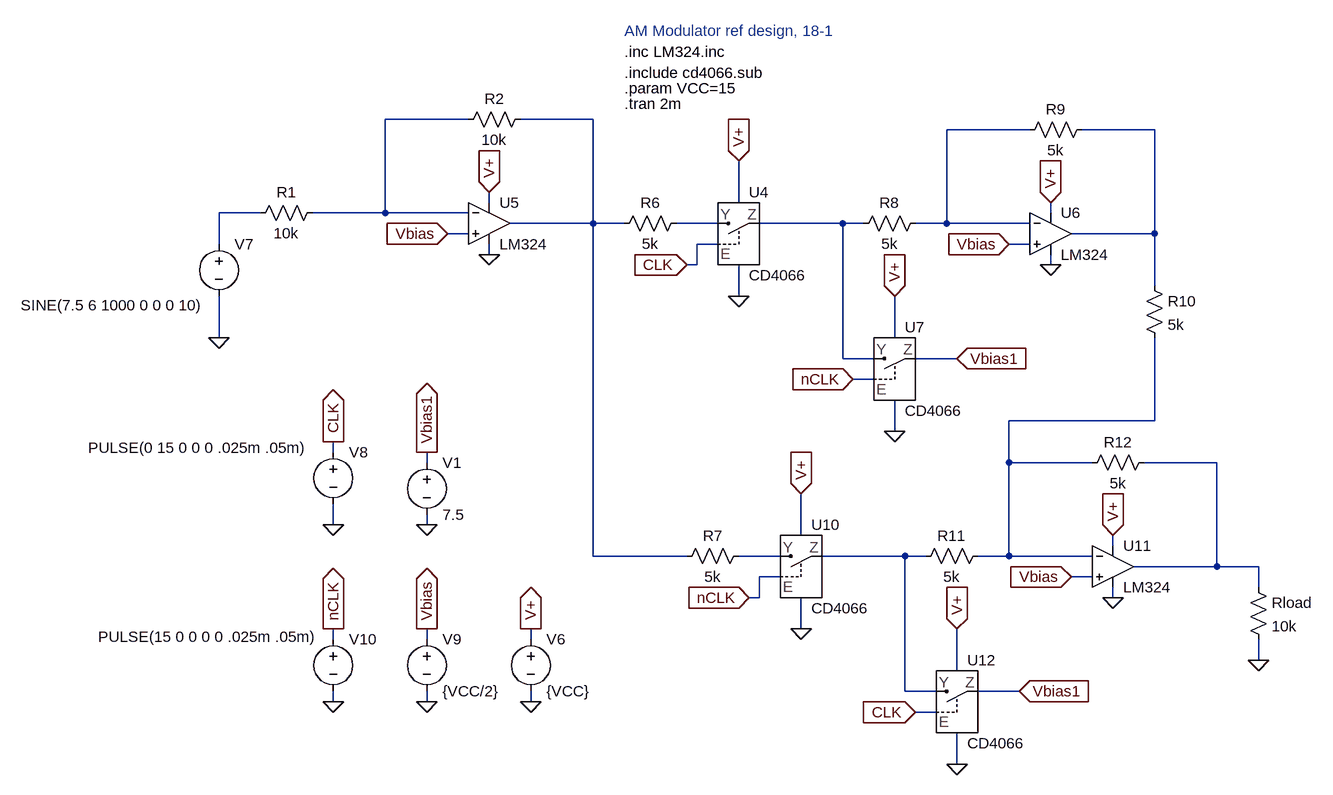
[diagram p0: schematic AM_modulator_ref_design.asc]
AM_modulator_ref_design.asc, the LTspice schematic file:
Version 4
SHEET 1 2644 1204
WIRE 1280 160 1152 160
WIRE 1472 160 1360 160
WIRE 2144 176 2016 176
WIRE 2336 176 2224 176
WIRE 1312 288 1312 272
WIRE 1696 288 1696 224
WIRE 960 304 896 304
WIRE 1152 304 1152 160
WIRE 1152 304 1040 304
WIRE 1280 304 1152 304
WIRE 2176 304 2176 288
WIRE 1472 320 1472 160
WIRE 1472 320 1344 320
WIRE 1520 320 1472 320
WIRE 1664 320 1600 320
WIRE 1856 320 1728 320
WIRE 1888 320 1856 320
WIRE 2016 320 2016 176
WIRE 2016 320 1968 320
WIRE 2144 320 2016 320
WIRE 1280 336 1248 336
WIRE 2336 336 2336 176
WIRE 2336 336 2208 336
WIRE 896 352 896 304
WIRE 1664 352 1632 352
WIRE 2144 352 2112 352
WIRE 1312 368 1312 352
WIRE 1632 384 1632 352
WIRE 1632 384 1616 384
WIRE 2176 384 2176 368
WIRE 2336 416 2336 336
WIRE 1696 432 1696 384
WIRE 896 496 896 432
WIRE 1936 496 1936 432
WIRE 1856 528 1856 320
WIRE 1904 528 1856 528
WIRE 2032 528 1968 528
WIRE 1904 560 1872 560
WIRE 2336 624 2336 496
WIRE 2336 624 2112 624
WIRE 1936 640 1936 592
WIRE 1072 672 1072 656
WIRE 1216 688 1216 672
WIRE 2112 688 2112 624
WIRE 2240 688 2112 688
WIRE 2432 688 2320 688
WIRE 1072 784 1072 752
WIRE 1216 784 1216 768
WIRE 1792 800 1792 736
WIRE 2272 816 2272 800
WIRE 1472 832 1472 320
WIRE 1616 832 1472 832
WIRE 1760 832 1696 832
WIRE 1952 832 1824 832
WIRE 1984 832 1952 832
WIRE 2112 832 2112 688
WIRE 2112 832 2064 832
WIRE 2240 832 2112 832
WIRE 2432 848 2432 688
WIRE 2432 848 2304 848
WIRE 2496 848 2432 848
WIRE 1760 864 1728 864
WIRE 2240 864 2208 864
WIRE 2496 880 2496 848
WIRE 1728 896 1728 864
WIRE 1728 896 1712 896
WIRE 2272 896 2272 880
WIRE 1792 944 1792 896
WIRE 1072 960 1072 944
WIRE 1216 960 1216 944
WIRE 1376 960 1376 944
WIRE 2496 992 2496 960
WIRE 2032 1008 2032 944
WIRE 1952 1040 1952 832
WIRE 2000 1040 1952 1040
WIRE 2128 1040 2064 1040
WIRE 1072 1056 1072 1040
WIRE 1216 1056 1216 1040
WIRE 1376 1056 1376 1040
WIRE 2000 1072 1968 1072
WIRE 2032 1152 2032 1104
FLAG 1312 272 V+
IOPIN 1312 272 In
FLAG 1312 368 0
FLAG 2176 288 V+
IOPIN 2176 288 In
FLAG 2176 384 0
FLAG 1376 1056 0
FLAG 1216 1056 0
FLAG 1216 944 Vbias
IOPIN 1216 944 Out
FLAG 1376 944 V+
IOPIN 1376 944 Out
FLAG 1248 336 Vbias
IOPIN 1248 336 In
FLAG 2112 352 Vbias
IOPIN 2112 352 In
FLAG 1696 224 V+
IOPIN 1696 224 In
FLAG 1696 432 0
FLAG 896 496 0
FLAG 1072 784 0
FLAG 1072 656 CLK
IOPIN 1072 656 Out
FLAG 1936 432 V+
IOPIN 1936 432 In
FLAG 1936 640 0
FLAG 1072 1056 0
FLAG 1072 944 nCLK
IOPIN 1072 944 Out
FLAG 1872 560 nCLK
IOPIN 1872 560 In
FLAG 1616 384 CLK
IOPIN 1616 384 In
FLAG 2272 800 V+
IOPIN 2272 800 In
FLAG 2272 896 0
FLAG 2208 864 Vbias
IOPIN 2208 864 In
FLAG 1792 736 V+
IOPIN 1792 736 In
FLAG 1792 944 0
FLAG 2032 944 V+
IOPIN 2032 944 In
FLAG 2032 1152 0
FLAG 1968 1072 CLK
IOPIN 1968 1072 In
FLAG 1712 896 nCLK
IOPIN 1712 896 In
FLAG 2496 992 0
FLAG 2032 528 Vbias1
IOPIN 2032 528 In
FLAG 2128 1040 Vbias1
IOPIN 2128 1040 In
FLAG 1216 784 0
FLAG 1216 672 Vbias1
IOPIN 1216 672 Out
SYMBOL CD4066 1696 336 R0
SYMATTR InstName U4
SYMBOL voltage 896 336 R0
WINDOW 123 0 0 Left 2
WINDOW 39 0 0 Left 2
WINDOW 3 -305 110 Left 2
SYMATTR Value SINE(7.5 6 1000 0 0 0 10)
SYMATTR InstName V7
SYMBOL res 1376 144 R90
WINDOW 0 0 56 VBottom 2
WINDOW 3 32 56 VTop 2
SYMATTR InstName R2
SYMATTR Value 10k
SYMBOL Opamps\\opamp2 1312 256 R0
SYMATTR InstName U5
SYMATTR Value LM324
SYMATTR SpiceModel LM324
SYMBOL res 1056 288 R90
WINDOW 0 0 56 VBottom 2
WINDOW 3 32 56 VTop 2
SYMATTR InstName R1
SYMATTR Value 10k
SYMBOL res 1616 304 R90
WINDOW 0 0 56 VBottom 2
WINDOW 3 32 56 VTop 2
SYMATTR InstName R6
SYMATTR Value 5k
SYMBOL res 2240 160 R90
WINDOW 0 0 56 VBottom 2
WINDOW 3 32 56 VTop 2
SYMATTR InstName R9
SYMATTR Value 5k
SYMBOL Opamps\\opamp2 2176 272 R0
SYMATTR InstName U6
SYMATTR Value LM324
SYMATTR SpiceModel LM324
SYMBOL res 1984 304 R90
WINDOW 0 0 56 VBottom 2
WINDOW 3 32 56 VTop 2
SYMATTR InstName R8
SYMATTR Value 5k
SYMBOL voltage 1376 944 R0
SYMATTR InstName V6
SYMATTR Value {VCC}
SYMBOL voltage 1216 944 R0
WINDOW 123 24 132 Left 2
WINDOW 39 0 0 Left 2
SYMATTR InstName V9
SYMATTR Value {VCC/2}
SYMBOL voltage 1072 656 R0
WINDOW 123 0 0 Left 2
WINDOW 39 0 0 Left 2
WINDOW 3 -377 9 Left 2
SYMATTR Value PULSE(0 15 0 0 0 .025m .05m)
SYMATTR InstName V8
SYMBOL CD4066 1936 544 R0
SYMATTR InstName U7
SYMBOL voltage 1072 944 R0
WINDOW 123 0 0 Left 2
WINDOW 39 0 0 Left 2
WINDOW 3 -362 12 Left 2
SYMATTR Value PULSE(15 0 0 0 0 .025m .05m)
SYMATTR InstName V10
SYMBOL CD4066 1792 848 R0
SYMATTR InstName U10
SYMBOL res 1712 816 R90
WINDOW 0 0 56 VBottom 2
WINDOW 3 32 56 VTop 2
SYMATTR InstName R7
SYMATTR Value 5k
SYMBOL res 2336 672 R90
WINDOW 0 0 56 VBottom 2
WINDOW 3 32 56 VTop 2
SYMATTR InstName R12
SYMATTR Value 5k
SYMBOL Opamps\\opamp2 2272 784 R0
SYMATTR InstName U11
SYMATTR Value LM324
SYMATTR SpiceModel LM324
SYMBOL res 2080 816 R90
WINDOW 0 0 56 VBottom 2
WINDOW 3 32 56 VTop 2
SYMATTR InstName R11
SYMATTR Value 5k
SYMBOL CD4066 2032 1056 R0
SYMATTR InstName U12
SYMBOL res 2320 400 R0
SYMATTR InstName R10
SYMATTR Value 5k
SYMBOL res 2480 864 R0
SYMATTR InstName Rload
SYMATTR Value 10k
SYMBOL voltage 1216 672 R0
WINDOW 123 24 132 Left 2
WINDOW 39 0 0 Left 2
SYMATTR InstName V1
SYMATTR Value 7.5
TEXT 1520 24 Left 2 ;AM Modulator ref design, 18-1
TEXT 1520 88 Left 2 !.include cd4066.sub
TEXT 1520 136 Left 2 !.tran 2m
TEXT 1520 56 Left 2 !.inc LM324.inc
TEXT 1520 112 Left 2 !.param VCC=15

The netlist it stands for:
* AM_modulator_ref_design.asc
XU4 CLK N006 N007 V+ 0 CD4066  ; pins EN Y OUT VCC VSS
V7 N005 0 SINE(7.5 6 1000 0 0 0 10)
R2 N002 N001 10k
XU5 Vbias N001 V+ 0 N002 LM324 LM324  ; pins In+ In- V+ V- OUT
R1 N001 N005 10k
R6 N006 N002 5k
R9 N004 N003 5k
XU6 Vbias N003 V+ 0 N004 LM324 LM324  ; pins In+ In- V+ V- OUT
R8 N003 N007 5k
V6 V+ 0 {VCC}
V9 Vbias 0 {VCC/2}
V8 CLK 0 PULSE(0 15 0 0 0 .025m .05m)
XU7 nCLK N007 Vbias1 V+ 0 CD4066  ; pins EN Y OUT VCC VSS
V10 nCLK 0 PULSE(15 0 0 0 0 .025m .05m)
XU10 nCLK N010 N011 V+ 0 CD4066  ; pins EN Y OUT VCC VSS
R7 N010 N002 5k
R12 N009 N008 5k
XU11 Vbias N008 V+ 0 N009 LM324 LM324  ; pins In+ In- V+ V- OUT
R11 N008 N011 5k
XU12 CLK N011 Vbias1 V+ 0 CD4066  ; pins EN Y OUT VCC VSS
R10 N004 N008 5k
Rload N009 0 10k
V1 Vbias1 0 7.5
* AM Modulator ref design, 18-1
.include cd4066.sub
.tran 2m
.inc LM324.inc
.param VCC=15
.backanno
.end